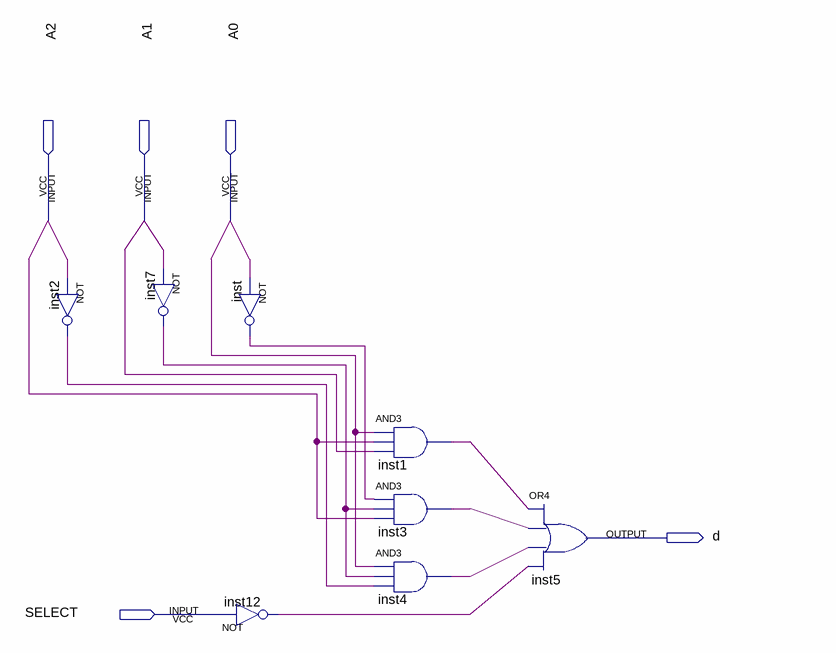
[diagram p0: schematic sheet]
// Quartus schematic segment_d.bdf as structural Verilog: 8 symbols, 5 pins
module segment_d (
  input  A2,
  input  A1,
  input  A0,
  input  SELECT,
  output d
);

  wire inst1_out, inst2_out, inst3_out, inst4_out, inst7_out, inst12_out, inst_out;

  not inst2 (inst2_out, A2);
  not inst7 (inst7_out, A1);
  not inst (inst_out, A0);
  not inst12 (inst12_out, SELECT);
  and inst1 (inst1_out, A0, A2, A1);
  and inst3 (inst3_out, inst_out, inst7_out, A2);
  and inst4 (inst4_out, A0, inst7_out, inst2_out);
  or inst5 (d, inst1_out, inst3_out, inst4_out, inst12_out);
endmodule
